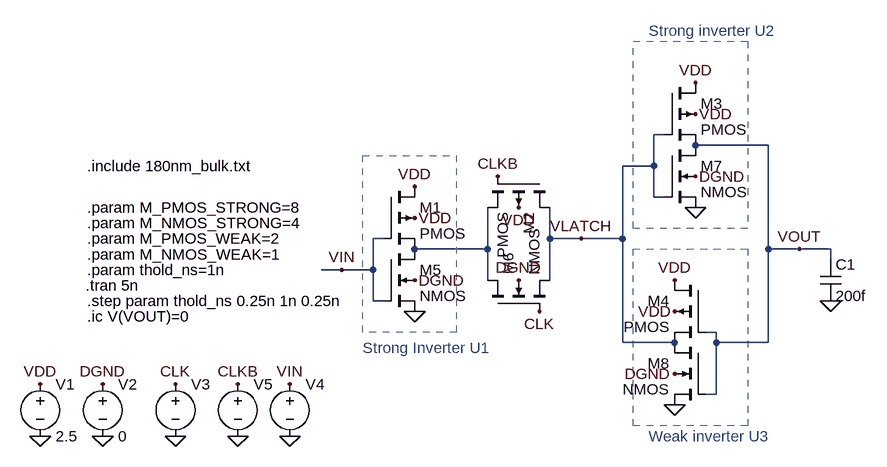
[diagram p0: schematic testbench.asc]
testbench.asc, the LTspice schematic file:
Version 4
SHEET 1 940 680
WIRE 576 32 560 32
WIRE 736 48 624 48
WIRE 560 80 560 32
WIRE 560 80 512 80
WIRE 560 128 560 80
WIRE 576 128 560 128
WIRE 144 192 128 192
WIRE 400 192 400 144
WIRE 448 192 400 192
WIRE 512 192 512 80
WIRE 512 192 448 192
WIRE 304 208 304 144
WIRE 304 208 192 208
WIRE 736 208 736 48
WIRE 784 208 736 208
WIRE 832 208 784 208
WIRE 832 224 832 208
WIRE 80 240 48 240
WIRE 128 240 128 192
WIRE 128 240 80 240
WIRE 304 256 304 208
WIRE 400 256 400 192
WIRE 128 288 128 240
WIRE 144 288 128 288
WIRE 656 336 640 336
WIRE 512 352 512 192
WIRE 592 352 512 352
WIRE 656 352 656 336
WIRE 736 352 736 208
WIRE 736 352 656 352
WIRE 656 432 656 352
WIRE 656 432 640 432
FLAG 192 160 VDD
FLAG 352 144 VDD
FLAG 624 0 VDD
FLAG 592 304 VDD
FLAG 192 256 DGND
FLAG 624 96 DGND
FLAG 592 400 DGND
FLAG -288 496 0
FLAG -384 496 0
FLAG 192 304 0
FLAG 352 256 DGND
FLAG 592 448 0
FLAG 624 144 0
FLAG 592 256 VDD
FLAG 624 -48 VDD
FLAG 192 112 VDD
FLAG 832 288 0
FLAG 784 208 VOUT
FLAG 384 304 CLK
FLAG 320 96 CLKB
FLAG 80 240 VIN
FLAG -384 416 VDD
FLAG -288 416 DGND
FLAG -176 496 0
FLAG 0 496 0
FLAG -176 416 CLK
FLAG 0 416 VIN
FLAG -80 496 0
FLAG -80 416 CLKB
FLAG 448 192 VLATCH
SYMBOL pmos4 144 112 R0
SYMATTR InstName M1
SYMATTR Value2 m={M_PMOS_STRONG}
SYMBOL pmos4 400 96 R90
SYMATTR InstName M2
SYMATTR Value2 m={M_PMOS_STRONG}
SYMBOL pmos4 576 -48 R0
SYMATTR InstName M3
SYMATTR Value2 m={M_PMOS_STRONG}
SYMBOL pmos4 640 256 M0
SYMATTR InstName M4
SYMATTR Value2 m={M_PMOS_WEAK}
SYMBOL nmos4 144 208 R0
SYMATTR InstName M5
SYMATTR Value2 m={M_NMOS_STRONG}
SYMBOL nmos4 304 304 R270
SYMATTR InstName M6
SYMATTR Value2 m={M_NMOS_STRONG}
SYMBOL nmos4 576 48 R0
SYMATTR InstName M7
SYMATTR Value2 m={M_NMOS_STRONG}
SYMBOL nmos4 640 352 M0
SYMATTR InstName M8
SYMATTR Value2 m={M_PMOS_WEAK}
SYMBOL voltage -384 400 R0
WINDOW 123 0 0 Left 0
WINDOW 39 0 0 Left 0
SYMATTR InstName V1
SYMATTR Value 2.5
SYMBOL voltage -288 400 R0
WINDOW 123 0 0 Left 0
WINDOW 39 0 0 Left 0
SYMATTR InstName V2
SYMATTR Value 0
SYMBOL cap 816 224 R0
SYMATTR InstName C1
SYMATTR Value 200f
SYMBOL voltage -176 400 R0
WINDOW 3 24 96 Invisible 2
WINDOW 123 0 0 Left 0
WINDOW 39 0 0 Left 0
SYMATTR InstName V3
SYMATTR Value PULSE(0 2.5 1n 0.1n 0.1n 0.9n 10n 1)
SYMBOL voltage 0 400 R0
WINDOW 3 24 96 Invisible 2
WINDOW 123 0 0 Left 0
WINDOW 39 0 0 Left 0
SYMATTR InstName V4
SYMATTR Value PULSE(0 2.5 0.5n 0.1n 0.1n {0.5n+thold_ns} 13n 1)
SYMBOL voltage -80 400 R0
WINDOW 3 24 96 Invisible 2
WINDOW 123 0 0 Left 0
WINDOW 39 0 0 Left 0
SYMATTR InstName V5
SYMATTR Value PULSE(2.5 0 1n 0.1n 0.1n 0.9n 10n 1)
TEXT -312 80 Left 2 !.include 180nm_bulk.txt
TEXT 552 -128 Left 2 ;Strong inverter U2
TEXT 552 496 Left 2 ;Weak inverter U3
TEXT 112 360 Left 2 ;Strong Inverter U1
TEXT -312 144 Left 2 !.param M_PMOS_STRONG=8
TEXT -312 168 Left 2 !.param M_NMOS_STRONG=4
TEXT -312 192 Left 2 !.param M_PMOS_WEAK=2
TEXT -312 216 Left 2 !.param M_NMOS_WEAK=1
TEXT -314 264 Left 2 !.tran 5n
TEXT -312 240 Left 2 !.param thold_ns=1n
TEXT -312 288 Left 2 !.step param thold_ns 0.25n 1n 0.25n
TEXT -312 312 Left 2 !.ic V(VOUT)=0
RECTANGLE Normal 704 176 528 -112 1
RECTANGLE Normal 704 480 528 208 1
RECTANGLE Normal 256 336 112 64 1

The netlist it stands for:
* testbench.asc
M1 VDD VIN N001 VDD PMOS m={M_PMOS_STRONG}
M2 VLATCH CLKB N001 VDD PMOS m={M_PMOS_STRONG}
M3 VDD VLATCH VOUT VDD PMOS m={M_PMOS_STRONG}
M4 VDD VOUT VLATCH VDD PMOS m={M_PMOS_WEAK}
M5 N001 VIN 0 DGND NMOS m={M_NMOS_STRONG}
M6 N001 CLK VLATCH DGND NMOS m={M_NMOS_STRONG}
M7 VOUT VLATCH 0 DGND NMOS m={M_NMOS_STRONG}
M8 VLATCH VOUT 0 DGND NMOS m={M_PMOS_WEAK}
V1 VDD 0 2.5
V2 DGND 0 0
C1 VOUT 0 200f
V3 CLK 0 PULSE(0 2.5 1n 0.1n 0.1n 0.9n 10n 1)
V4 VIN 0 PULSE(0 2.5 0.5n 0.1n 0.1n {0.5n+thold_ns} 13n 1)
V5 CLKB 0 PULSE(2.5 0 1n 0.1n 0.1n 0.9n 10n 1)
.model NMOS NMOS
.model PMOS PMOS
.lib standard.mos
.include 180nm_bulk.txt
* Strong inverter U2
* Weak inverter U3
* Strong Inverter U1
.param M_PMOS_STRONG=8
.param M_NMOS_STRONG=4
.param M_PMOS_WEAK=2
.param M_NMOS_WEAK=1
.tran 5n
.param thold_ns=1n
.step param thold_ns 0.25n 1n 0.25n
.ic V(VOUT)=0
.backanno
.end